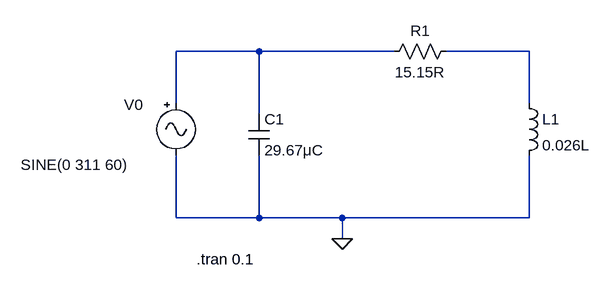
[diagram p0: schematic Circuito_com_capacitor.asc]
Circuito_com_capacitor.asc, the LTspice schematic file:
Version 4
SHEET 1 880 680
WIRE 64 64 -64 64
WIRE 272 64 64 64
WIRE 480 64 352 64
WIRE -64 144 -64 64
WIRE 480 144 480 64
WIRE 64 160 64 64
WIRE -64 320 -64 224
WIRE 64 320 64 224
WIRE 64 320 -64 320
WIRE 192 320 64 320
WIRE 480 320 480 224
WIRE 480 320 192 320
WIRE 192 352 192 320
FLAG 192 352 0
SYMBOL Misc\\signal -64 128 R0
WINDOW 0 -80 18 Left 2
WINDOW 3 -239 110 Left 2
WINDOW 123 0 0 Left 0
WINDOW 39 -239 144 Left 2
SYMATTR InstName V0
SYMATTR Value SINE(0 311 60)
SYMBOL res 368 48 R90
WINDOW 0 0 56 VBottom 2
WINDOW 3 32 56 VTop 2
SYMATTR InstName R1
SYMATTR Value 15.15R
SYMBOL ind 464 128 R0
SYMATTR InstName L1
SYMATTR Value 0.026L
SYMBOL cap 48 160 R0
SYMATTR InstName C1
SYMATTR Value 29.67μC
TEXT -32 384 Left 2 !.tran 0.1

The netlist it stands for:
* Circuito_com_capacitor.asc
V0 N001 0 SINE(0 311 60)
R1 N002 N001 15.15R
L1 N002 0 0.026L
C1 N001 0 29.67μC
.tran 0.1
.backanno
.end